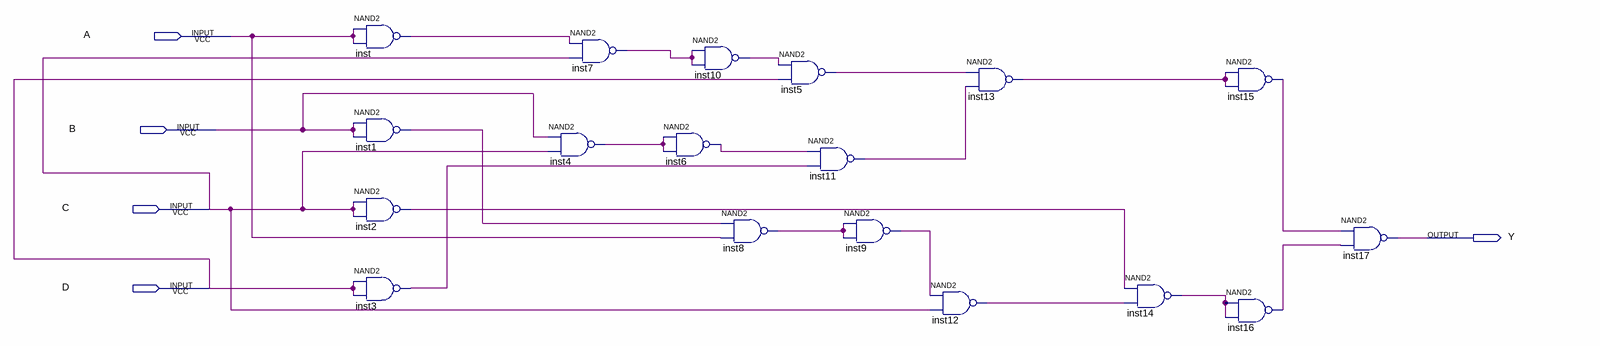
[diagram p0: schematic sheet]
// Quartus schematic lab2.bdf as structural Verilog: 18 symbols, 5 pins
module lab2 (
  input  A,
  input  B,
  input  C,
  input  D,
  output Y
);

  wire inst1_out, inst2_out, inst3_out, inst4_out, inst5_out, inst6_out, inst7_out, inst8_out, inst9_out,
       inst10_out, inst11_out, inst12_out, inst13_out, inst14_out, inst15_out, inst16_out, inst_out;

  nand inst (inst_out, A, A);
  nand inst1 (inst1_out, B, B);
  nand inst2 (inst2_out, C, C);
  nand inst3 (inst3_out, D, D);
  nand inst4 (inst4_out, B, C);
  nand inst7 (inst7_out, inst_out, C);
  nand inst6 (inst6_out, inst4_out, inst4_out);
  nand inst10 (inst10_out, inst7_out, inst7_out);
  nand inst8 (inst8_out, inst1_out, A);
  nand inst5 (inst5_out, inst10_out, D);
  nand inst11 (inst11_out, inst6_out, inst3_out);
  nand inst9 (inst9_out, inst8_out, inst8_out);
  nand inst12 (inst12_out, inst9_out, C);
  nand inst13 (inst13_out, inst5_out, inst11_out);
  nand inst14 (inst14_out, inst2_out, inst12_out);
  nand inst15 (inst15_out, inst13_out, inst13_out);
  nand inst16 (inst16_out, inst14_out, inst14_out);
  nand inst17 (Y, inst15_out, inst16_out);
endmodule
